# EAGLE schematic relay (EAGLE 7.4.0)
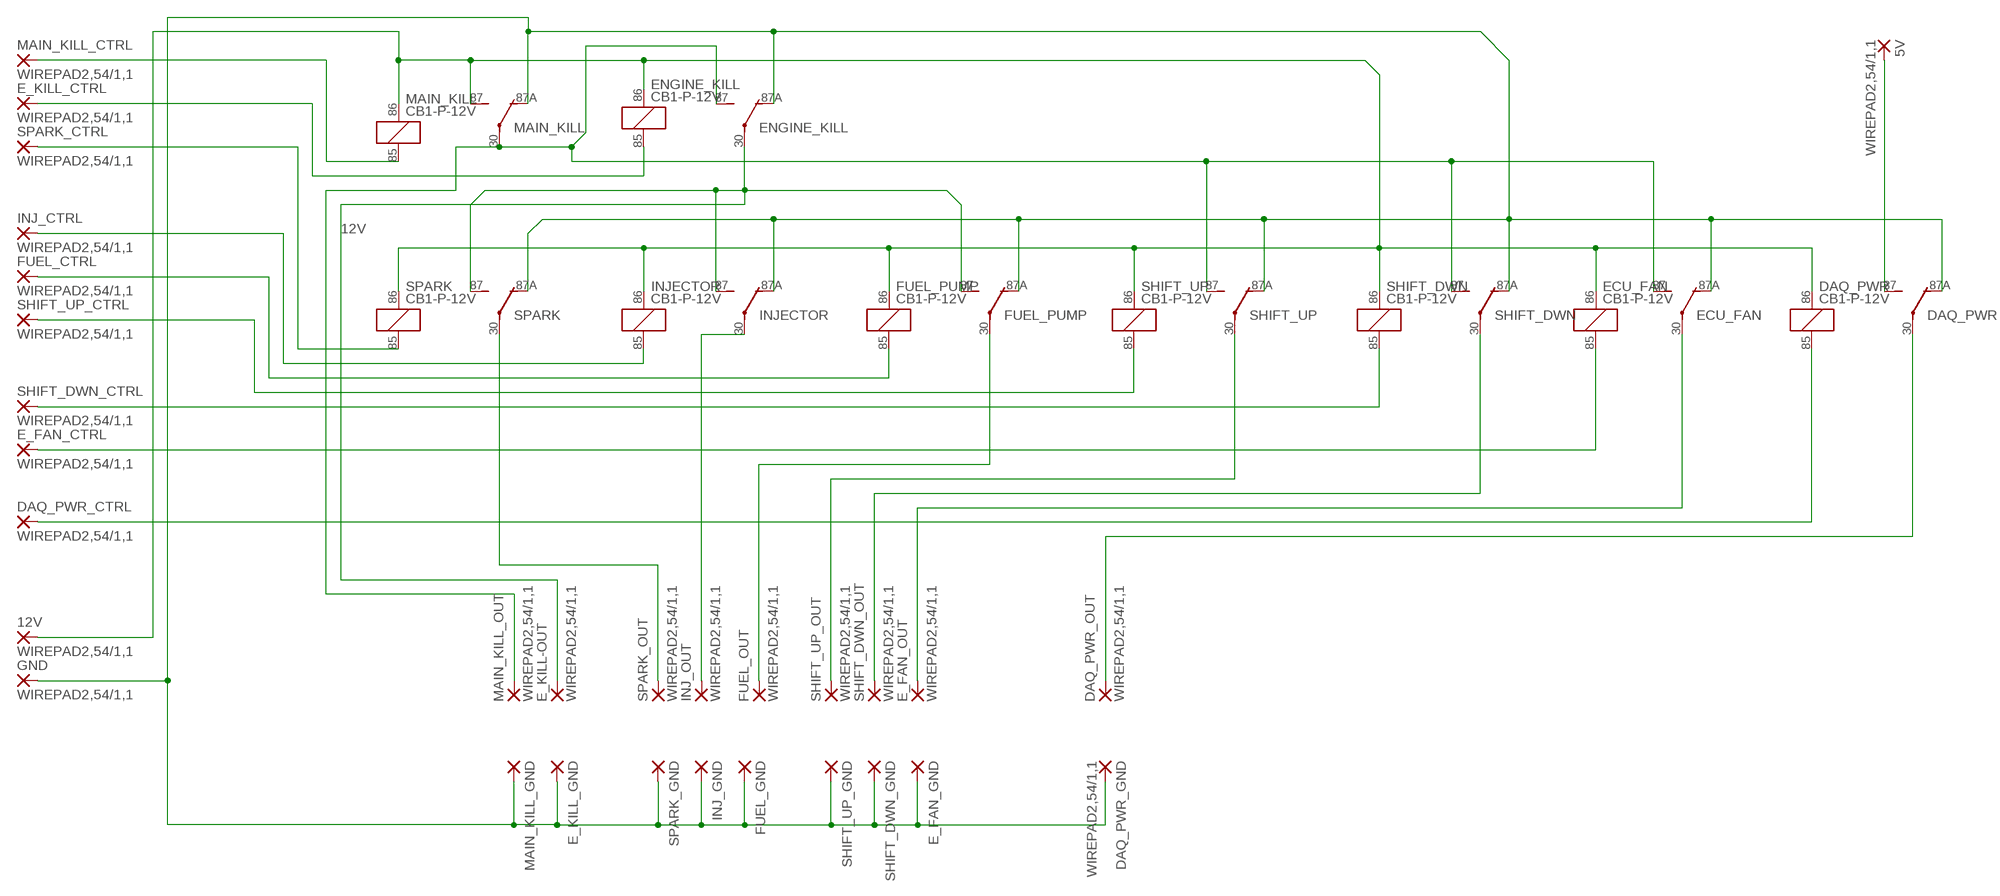
[diagram p0: schematic, sheet 1]

## Parts
5V  WIREPAD2,54/1,1  [2,54/1,1]
12V  WIREPAD2,54/1,1  [2,54/1,1]
DAQ_PWR  CB1-P-12V  [CB1]
DAQ_PWR_CTRL  WIREPAD2,54/1,1  [2,54/1,1]
DAQ_PWR_GND  WIREPAD2,54/1,1  [2,54/1,1]
DAQ_PWR_OUT  WIREPAD2,54/1,1  [2,54/1,1]
E_FAN_CTRL  WIREPAD2,54/1,1  [2,54/1,1]
E_FAN_GND  2,54/0,9  [2,54/0,9]
E_FAN_OUT  WIREPAD2,54/1,1  [2,54/1,1]
E_KILL-OUT  WIREPAD2,54/1,1  [2,54/1,1]
E_KILL_CTRL  WIREPAD2,54/1,1  [2,54/1,1]
E_KILL_GND  2,54/0,9  [2,54/0,9]
ECU_FAN  CB1-P-12V  [CB1]
ENGINE_KILL  CB1-P-12V  [CB1]
FUEL_CTRL  WIREPAD2,54/1,1  [2,54/1,1]
FUEL_GND  2,54/0,9  [2,54/0,9]
FUEL_OUT  WIREPAD2,54/1,1  [2,54/1,1]
FUEL_PUMP  CB1-P-12V  [CB1]
GND  WIREPAD2,54/1,1  [2,54/1,1]
INJ_CTRL  WIREPAD2,54/1,1  [2,54/1,1]
INJ_GND  2,54/0,9  [2,54/0,9]
INJ_OUT  WIREPAD2,54/1,1  [2,54/1,1]
INJECTOR  CB1-P-12V  [CB1]
MAIN_KILL  CB1-P-12V  [CB1]
MAIN_KILL_CTRL  WIREPAD2,54/1,1  [2,54/1,1]
MAIN_KILL_GND  2,54/0,9  [2,54/0,9]
MAIN_KILL_OUT  WIREPAD2,54/1,1  [2,54/1,1]
SHIFT_DWN  CB1-P-12V  [CB1]
SHIFT_DWN_CTRL  WIREPAD2,54/1,1  [2,54/1,1]
SHIFT_DWN_GND  2,54/0,9  [2,54/0,9]
SHIFT_DWN_OUT  WIREPAD2,54/1,1  [2,54/1,1]
SHIFT_UP  CB1-P-12V  [CB1]
SHIFT_UP_CTRL  WIREPAD2,54/1,1  [2,54/1,1]
SHIFT_UP_GND  2,54/0,9  [2,54/0,9]
SHIFT_UP_OUT  WIREPAD2,54/1,1  [2,54/1,1]
SPARK  CB1-P-12V  [CB1]
SPARK_CTRL  WIREPAD2,54/1,1  [2,54/1,1]
SPARK_GND  2,54/0,9  [2,54/0,9]
SPARK_OUT  WIREPAD2,54/1,1  [2,54/1,1]

## Nets
12V: 12V.1(P) DAQ_PWR.86 ECU_FAN.86 ENGINE_KILL.86 FUEL_PUMP.86 INJECTOR.86 MAIN_KILL.86 MAIN_KILL.87(2:S) SHIFT_DWN.86 SHIFT_UP.86 SPARK.86
GND: DAQ_PWR.87A(2:O) DAQ_PWR_GND.1(P) E_FAN_GND.1(P) E_KILL_GND.1(P) ECU_FAN.87A(2:O) ENGINE_KILL.87A(2:O) FUEL_GND.1(P) FUEL_PUMP.87A(2:O) GND.1(P) INJ_GND.1(P) INJECTOR.87A(2:O) MAIN_KILL.87A(2:O) MAIN_KILL_GND.1(P) SHIFT_DWN.87A(2:O) SHIFT_DWN_GND.1(P) SHIFT_UP.87A(2:O) SHIFT_UP_GND.1(P) SPARK.87A(2:O) SPARK_GND.1(P)
N$1: E_FAN_CTRL.1(P) ECU_FAN.85
N$2: ECU_FAN.87(2:S) ENGINE_KILL.87(2:S) MAIN_KILL.30(2:P) MAIN_KILL_OUT.1(P) SHIFT_DWN.87(2:S) SHIFT_UP.87(2:S)
N$3: E_KILL_CTRL.1(P) ENGINE_KILL.85
N$4: SPARK.30(2:P) SPARK_OUT.1(P)
N$5: E_KILL-OUT.1(P) ENGINE_KILL.30(2:P) FUEL_PUMP.87(2:S) INJECTOR.87(2:S) SPARK.87(2:S)
N$6: MAIN_KILL.85 MAIN_KILL_CTRL.1(P)
N$7: SPARK.85 SPARK_CTRL.1(P)
N$8: INJ_OUT.1(P) INJECTOR.30(2:P)
N$9: FUEL_OUT.1(P) FUEL_PUMP.30(2:P)
N$10: 5V.1(P) DAQ_PWR.87(2:S)
N$11: INJ_CTRL.1(P) INJECTOR.85
N$12: SHIFT_UP.85 SHIFT_UP_CTRL.1(P)
N$13: SHIFT_DWN.85 SHIFT_DWN_CTRL.1(P)
N$14: SHIFT_DWN.30(2:P) SHIFT_DWN_OUT.1(P)
N$15: FUEL_CTRL.1(P) FUEL_PUMP.85
N$16: E_FAN_OUT.1(P) ECU_FAN.30(2:P)
N$17: DAQ_PWR.30(2:P) DAQ_PWR_OUT.1(P)
N$18: DAQ_PWR.85 DAQ_PWR_CTRL.1(P)
N$22: SHIFT_UP.30(2:P) SHIFT_UP_OUT.1(P)

## Library data of the parts
5V 12V DAQ_PWR_CTRL DAQ_PWR_GND DAQ_PWR_OUT E_FAN_CTRL E_FAN_OUT E_KILL-OUT E_KILL_CTRL FUEL_CTRL FUEL_OUT GND INJ_CTRL INJ_OUT MAIN_KILL_CTRL MAIN_KILL_OUT SHIFT_DWN_CTRL SHIFT_DWN_OUT SHIFT_UP_CTRL SHIFT_UP_OUT SPARK_CTRL SPARK_OUT = wirepad:WIREPAD: Wire PAD connect wire on PCB
DAQ_PWR ECU_FAN ENGINE_KILL FUEL_PUMP INJECTOR MAIN_KILL SHIFT_DWN SHIFT_UP SPARK = relay:CB1*: HIGH POWER AUTOMOTIVE RELAY Form C NAiS Source: http://www.mew-europe.com/.. en_ds_61202_0000.pdf; MF: AROMAT/ MATSUSHITA; MPN: CB1-P-12V; OC_FARNELL: unknown; OC_NEWARK: 52F9201
E_FAN_GND E_KILL_GND FUEL_GND INJ_GND MAIN_KILL_GND SHIFT_DWN_GND SHIFT_UP_GND SPARK_GND = wirepad:2,54/0,9: THROUGH-HOLE PAD

## Net classes
0 default: width 1.016 mm, clearance 0.508 mm